# EasyEDA schematic ControlDevBoard.json
TITLE: Daisy Seed Control Dev Board; REV: 1.0; Date: 2024-04-03; Sheet: 1/1; Drawn By: sh.omid.m
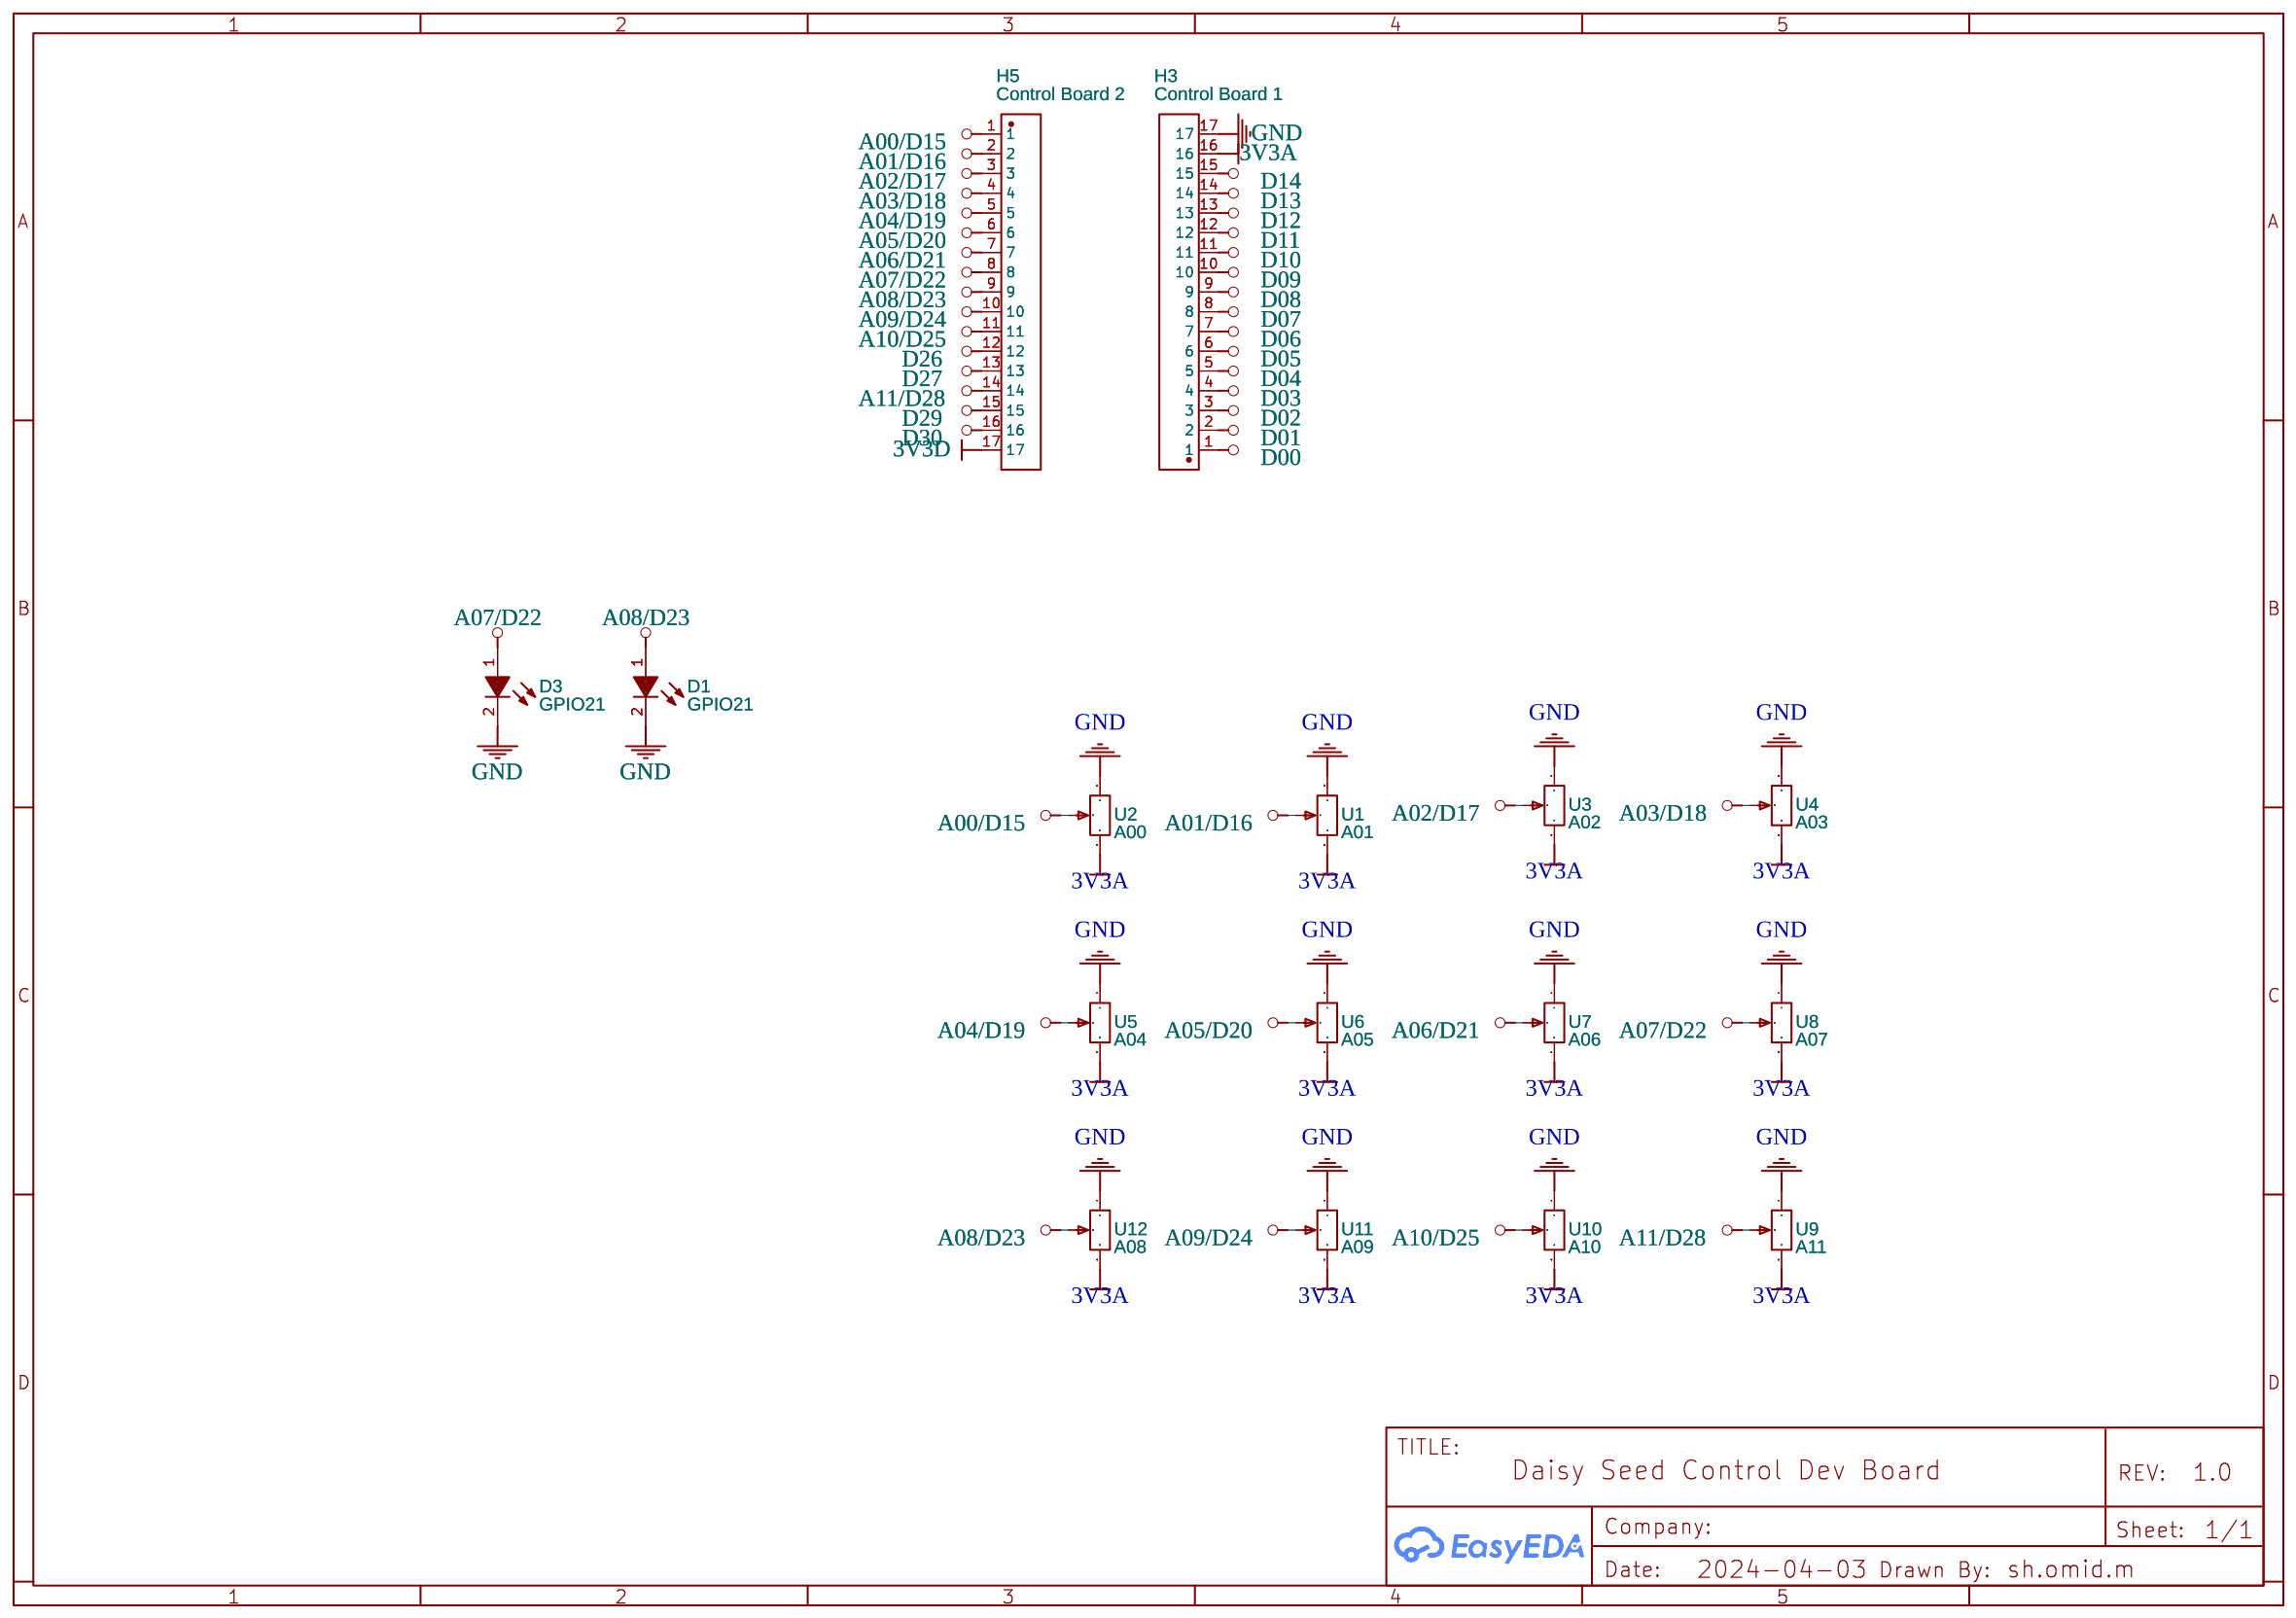
[diagram p0: schematic sheet]

## Parts
D1  GPIO21  [LED-TH_LED-DP2-2LED]
D3  GPIO21  [LED-TH_LED-DP2-2LED]
H3  Control Board 1  [HDR-TH_17P-P2.54-V-M]
H5  Control Board 2  [HDR-TH_17P-P2.54-V-M]
U1  A01  [POTENTIOMETER]
U2  A00  [POTENTIOMETER]
U3  A02  [POTENTIOMETER]
U4  A03  [POTENTIOMETER]
U5  A04  [POTENTIOMETER]
U6  A05  [POTENTIOMETER]
U7  A06  [POTENTIOMETER]
U8  A07  [POTENTIOMETER]
U9  A11  [POTENTIOMETER]
U10  A10  [POTENTIOMETER]
U11  A09  [POTENTIOMETER]
U12  A08  [POTENTIOMETER]

## Library data of the parts
D1 D3 = 3mm Green TH LED 5600: Supplier: Digi-Key; Manufacturer: VccLite; Manufacturer Part: 5600; Supplier Part: L20325-ND; link: https://vcclite.com/product/5602f5-5v/; Contributor: 2022.kaustubh.natalkar
H3 H5 = PZ254-1-17-Z-8.5: Contributor: LCSC; Supplier: LCSC; Supplier Part: C2894940; Manufacturer: HCTL(华灿天禄); JLCPCB Part Class: Extended Part
U1-U12 = Potentiometer: Supplier Part: undefined; Supplier: LCSC; Manufacturer Part: EVND8AA03B13; Contributor: digitalPatrick

## Nets
3V3A: H3.16 U1.3 U2.3 U3.3 U4.3 U5.3 U6.3 U7.3 U8.3 U9.3 U10.3 U11.3 U12.3
3V3D: H5.17
GND: D1.2(K) D3.2(K) H3.17 U1.1 U2.1 U3.1 U4.1 U5.1 U6.1 U7.1 U8.1 U9.1 U10.1 U11.1 U12.1
A00/D15: H5.1 U2.2
A01/D16: H5.2 U1.2
A02/D17: H5.3 U3.2
A03/D18: H5.4 U4.2
A04/D19: H5.5 U5.2
A05/D20: H5.6 U6.2
A06/D21: H5.7 U7.2
A07/D22: D3.1(A) H5.8 U8.2
A08/D23: D1.1(A) H5.9 U12.2
A09/D24: H5.10 U11.2
A10/D25: H5.11 U10.2
A11/D28: H5.14 U9.2
D00: H3.1
D01: H3.2
D02: H3.3
D03: H3.4
D04: H3.5
D05: H3.6
D06: H3.7
D07: H3.8
D08: H3.9
D09: H3.10
D10: H3.11
D11: H3.12
D12: H3.13
D13: H3.14
D14: H3.15
D26: H5.12
D27: H5.13
D29: H5.15
D30: H5.16
